# Altium schematic sheet 42. DISPLAY PORT.SchDoc: DISPLAY_PORT_INTERFACE
size 513 x 386 mm; Project: PROC154E2(001)_SK_AM69; Issue: 1.0; RevCode: E3; Page Create Date: March  8, 1995; Variant Name: Core Design; Schematic Page Number: 42; Page Number: 42; Page Size: C; Comment: MISTRAL_TITLEBLK_CSIZE_1; Page Count: 62; Schematic Page Count: 62; Name: PROC154E2 001 SK AM69; DsnPath: C:\Users\danie\Downloads\sprr466c\PROC154E3_RP\PROC154E3_SCH.DSN; SchematicName: SCHEMATIC1; PageName: 42. DISPLAY PORT; PageSize: C; TopSchematic: True
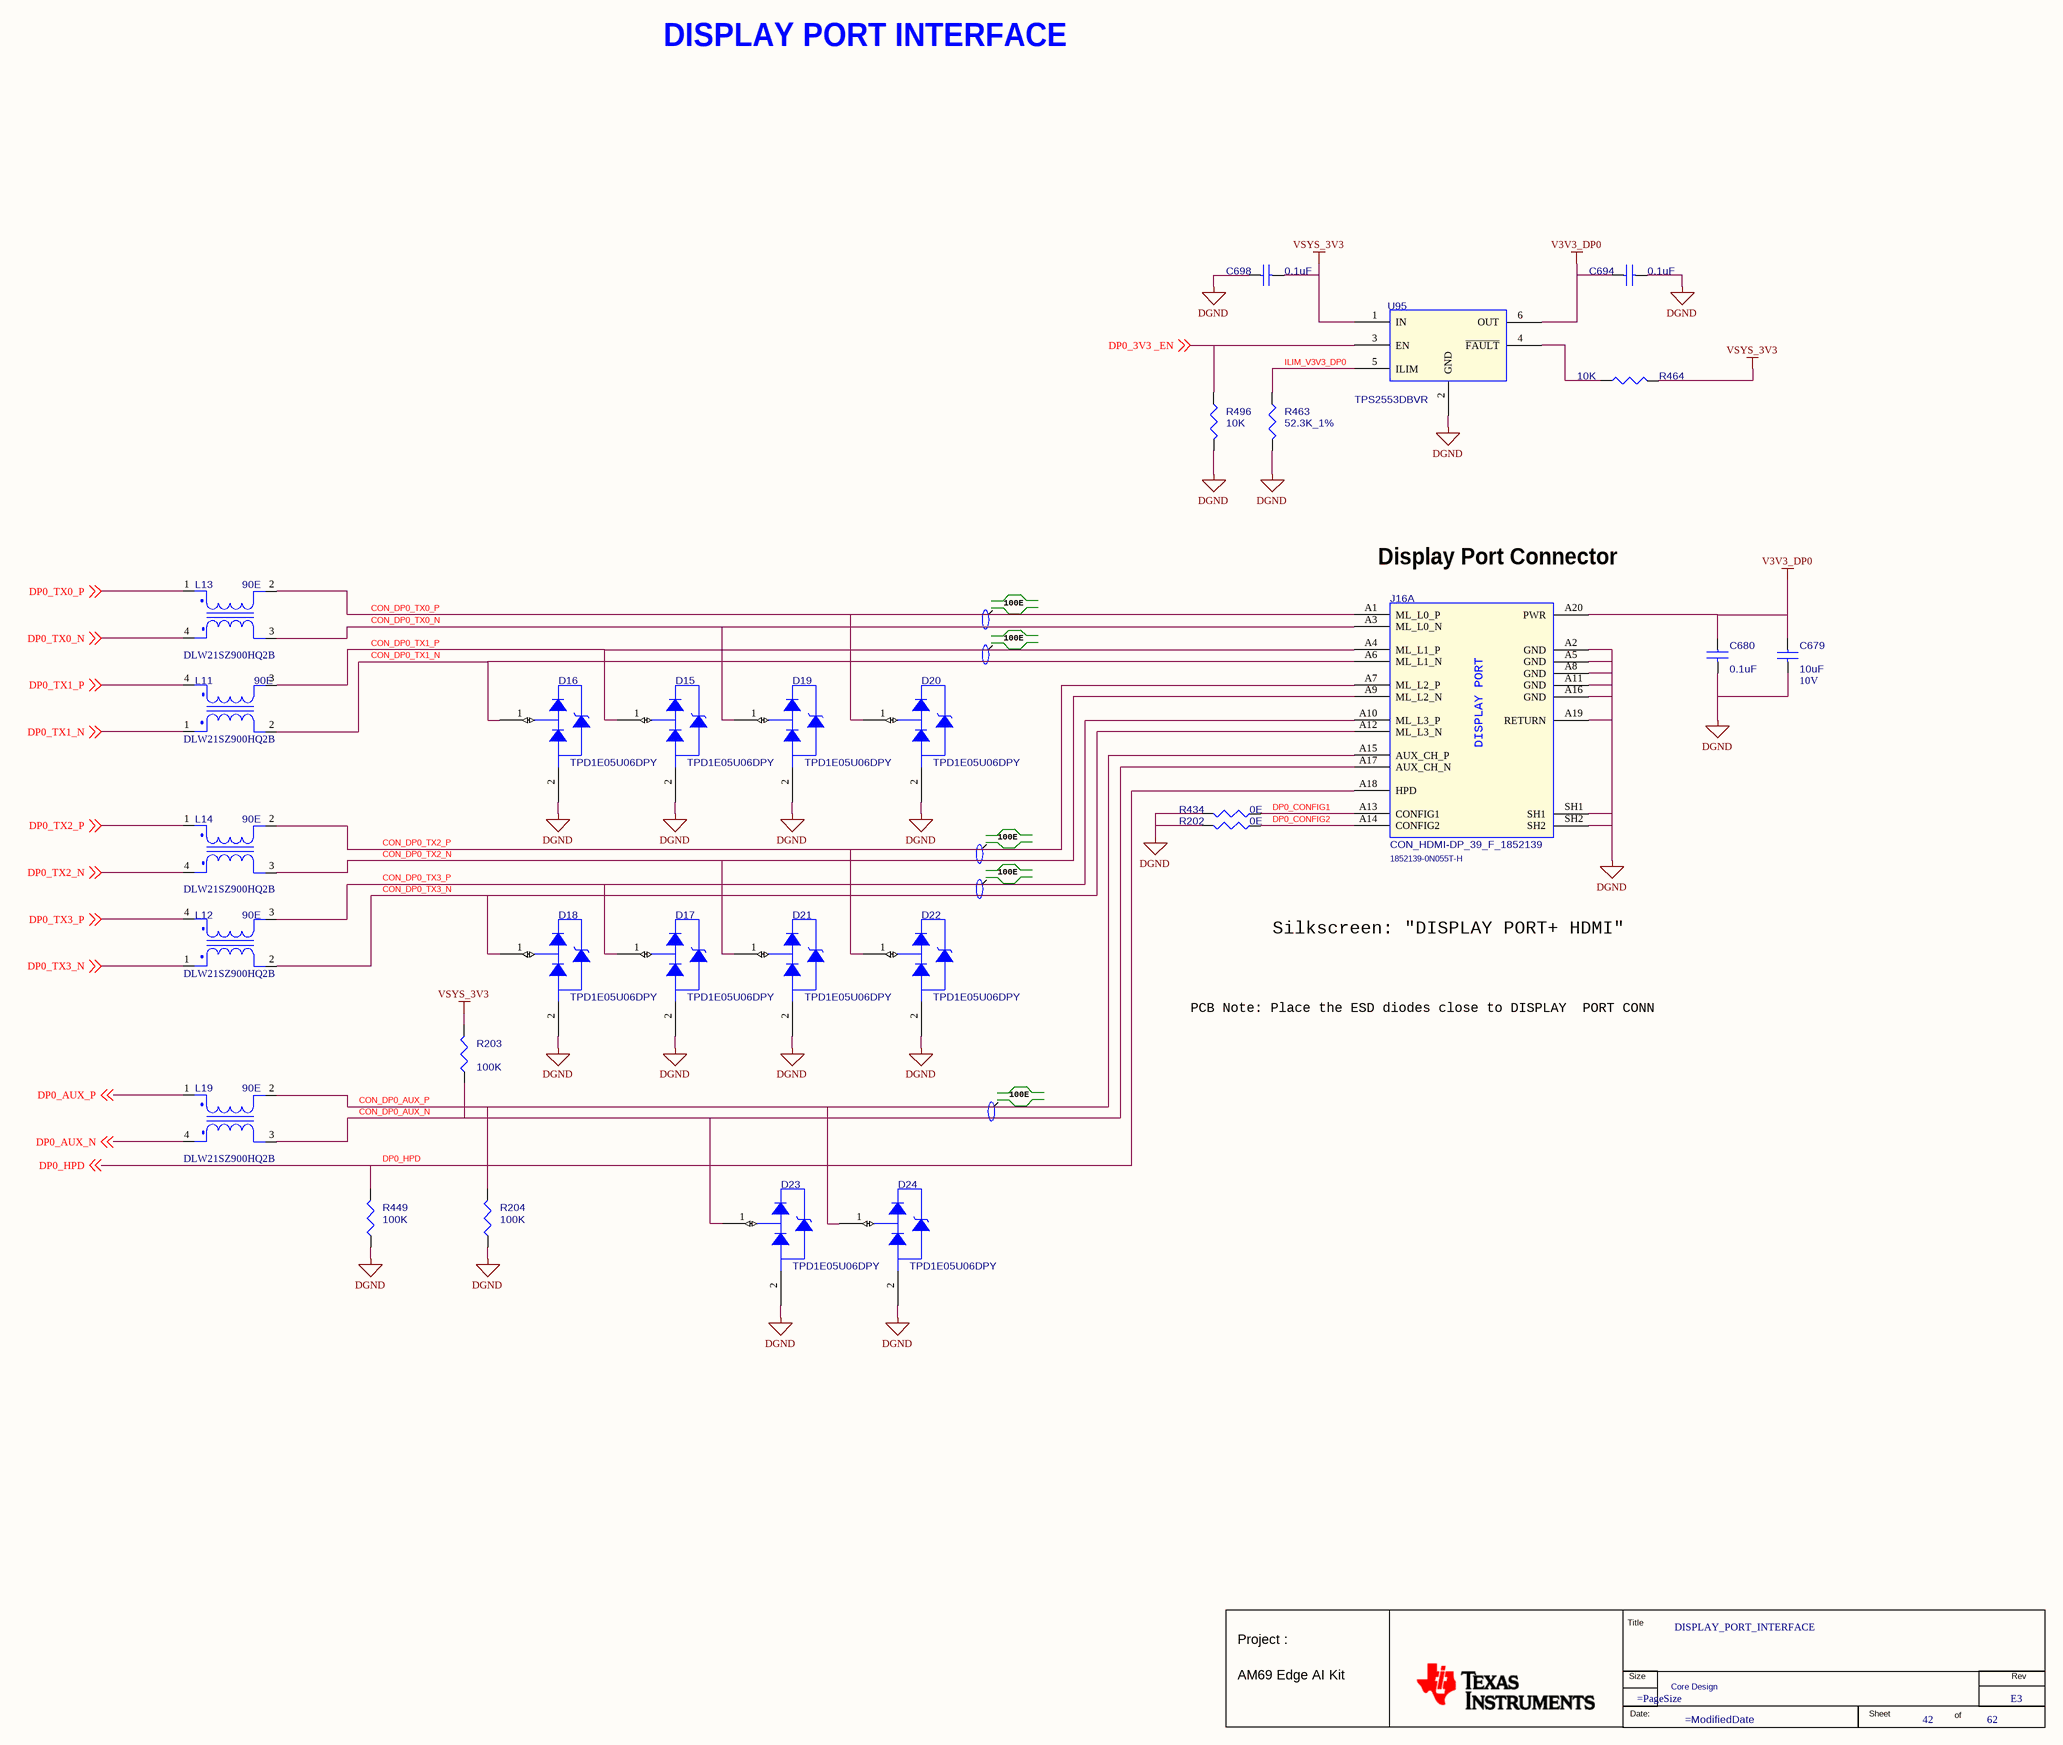
[diagram p0: 42. DISPLAY PORT.SchDoc]

## Parts
*  RevCode: E3  Title: DISPLAY_PORT_INTERFACE  Page Number: 42  Page Count: 62  Variant Name: Core Design  (hidden comment: MISTRAL_TITLEBLK_CSIZE_1)  (graphical)
C679  10uF  Voltage: 10V  [CAP0402_1]
C680  0.1uF  [CAP0201_0-5]
C694  0.1uF  [CAP0201_0-5]
C698  0.1uF  [CAP0201_0-5]
D15  TPD1E05U06DPY  [DIO_DFN0402_0-5]
D16  TPD1E05U06DPY  [DIO_DFN0402_0-5]
D17  TPD1E05U06DPY  [DIO_DFN0402_0-5]
D18  TPD1E05U06DPY  [DIO_DFN0402_0-5]
D19  TPD1E05U06DPY  [DIO_DFN0402_0-5]
D20  TPD1E05U06DPY  [DIO_DFN0402_0-5]
D21  TPD1E05U06DPY  [DIO_DFN0402_0-5]
D22  TPD1E05U06DPY  [DIO_DFN0402_0-5]
D23  TPD1E05U06DPY  [DIO_DFN0402_0-5]
D24  TPD1E05U06DPY  [DIO_DFN0402_0-5]
J16  CON_HDMI-DP_39_F_1852139  Mfr_part_number: 1852139-0N055T-H  [CON_HDMI-DP39_1852139-0N055_S_R_T_19-8]  (part A of 2)
L11  90E  Mfr_part_number: DLW21SZ900HQ2B  [IND4_DLW21H_90X60_SMD_1-4]
L12  90E  Mfr_part_number: DLW21SZ900HQ2B  [IND4_DLW21H_90X60_SMD_1-4]
L13  90E  Mfr_part_number: DLW21SZ900HQ2B  [IND4_DLW21H_90X60_SMD_1-4]
L14  90E  Mfr_part_number: DLW21SZ900HQ2B  [IND4_DLW21H_90X60_SMD_1-4]
L19  90E  Mfr_part_number: DLW21SZ900HQ2B  [IND4_DLW21H_90X60_SMD_1-4]
R202  0E  [RES0402_0-5]
R203  100K  [RES0402_0-5]
R204  100K  [RES0402_0-5]
R434  0E  [RES0402_0-5]
R449  100K  [RES0402_0-5]
R463  52.3K_1%  [RES0201_0-5]
R464  10K  [RES0201_0-5]
R496  10K  [RES0201_0-5]
U95  TPS2553DBVR  [SOT23-6_1-5]

## Nets
DGND: C679.2 C680.2 C694.2 C698.1 D15.2(GND) D16.2(GND) D17.2(GND) D18.2(GND) D19.2(GND) D20.2(GND) D21.2(GND) D22.2(GND) D23.2(GND) D24.2(GND) J16.A2(GND) J16.A5(GND) J16.A8(GND) J16.A11(GND) J16.A16(GND) J16.A19(RETURN) J16.SH1 J16.SH2 R202.2 R204.1 R434.2 R449.1 R463.2 R496.2 U95.2(GND)
V3V3_DP0: C679.1 C680.1 C694.1 J16.A20(PWR) U95.6(OUT)
VSYS_3V3: C698.2 R203.2 R464.1 U95.1(IN)
CON_DP0_AUX_N: D23.1(I/O) J16.A17(AUX_CH_N) L19.3(OUT1) R203.1
CON_DP0_AUX_P: D24.1(I/O) J16.A15(AUX_CH_P) L19.2(IN2) R204.2
CON_DP0_TX0_N: D19.1(I/O) J16.A3(ML_L0_N) L13.3(OUT1)
CON_DP0_TX0_P: D20.1(I/O) J16.A1(ML_L0_P) L13.2(IN2)
CON_DP0_TX1_N: D16.1(I/O) J16.A6(ML_L1_N) L11.2(IN2)
CON_DP0_TX1_P: D15.1(I/O) J16.A4(ML_L1_P) L11.3(OUT1)
CON_DP0_TX2_N: D21.1(I/O) J16.A9(ML_L2_N) L14.3(OUT1)
CON_DP0_TX2_P: D22.1(I/O) J16.A7(ML_L2_P) L14.2(IN2)
CON_DP0_TX3_N: D18.1(I/O) J16.A12(ML_L3_N) L12.2(IN2)
CON_DP0_TX3_P: D17.1(I/O) J16.A10(ML_L3_P) L12.3(OUT1)
DP0_3V3 _EN: R496.1 U95.3(EN) ; off-sheet DP0_3V3 _EN
DP0_AUX_N: L19.4(OUT2) ; off-sheet DP0_AUX_N
DP0_AUX_P: L19.1(IN1) ; off-sheet DP0_AUX_P
DP0_CONFIG1: J16.A13(CONFIG1) R434.1
DP0_CONFIG2: J16.A14(CONFIG2) R202.1
DP0_HPD: J16.A18(HPD) R449.2 ; off-sheet DP0_HPD
DP0_TX0_N: L13.4(OUT2) ; off-sheet DP0_TX0_N
DP0_TX0_P: L13.1(IN1) ; off-sheet DP0_TX0_P
DP0_TX1_N: L11.1(IN1) ; off-sheet DP0_TX1_N
DP0_TX1_P: L11.4(OUT2) ; off-sheet DP0_TX1_P
DP0_TX2_N: L14.4(OUT2) ; off-sheet DP0_TX2_N
DP0_TX2_P: L14.1(IN1) ; off-sheet DP0_TX2_P
DP0_TX3_N: L12.1(IN1) ; off-sheet DP0_TX3_N
DP0_TX3_P: L12.4(OUT2) ; off-sheet DP0_TX3_P
ILIM_V3V3_DP0: R463.1 U95.5(ILIM)
NetR464_2: R464.2 U95.4(~{FAULT})

## Notes on the sheet
- DISPLAY PORT INTERFACE
- (near J16) Display Port Connector
- 100E
- Silkscreen: "DISPLAY PORT+ HDMI"
- PCB Note: Place the ESD diodes close to DISPLAY  PORT CONN
- (in symbol CON_HDMI-DP_39_F_1852139, part A) DISPLAY PORT
- (in symbol MISTRAL_TITLEBLK_CSIZE_1) Title; Project :; Size; Rev; AM69 Edge AI Kit; Date:; Sheet; of

## Library data of the parts
* = MISTRAL_TITLEBLK_CSIZE_1: Issue: 1.0; Project: PROC154E2(001)_SK_AM69; Name: PROC154E2 001 SK AM69; Page Create Date: March  8, 1995; Page Size: =PageSize; Page Modify Date: =ModifiedDate; Schematic Page Count: 62; Schematic Page Number: 42
C679 = CAP_Dup1: CAP CERAMIC 10uF 10V 20% X5R 0402; Part Reference: C679; Part_type: CAPACITORS\CERAMIC; Mfr_part_number: CL05A106MP8NUB8; Mfr_name: SAMSUNG; Mistral Part No: 120019020008-R; Custom_Duty: 15%; Customs_HS_Code: 85322990; Project: TI_60GHz-AOP; Wattage: NA; Value: 10uF; PCB Footprint: CAP0402_1; Chkd/date: MANIRAJA/150219; Crtd /date: ALVY/150219; Datasheet: Y:\MIS_DATABASE\DATASHEETS\CAPACITORS\CL05A106MP8NUB8.PDF; Height: 0.90MM; Distributor_part_number: 1276-6830-1-ND; Distributor_name: DIGIKEY; Package: 0402; Tolerance: 20%; Library Ref: CAP; Footprint Ref: CAP0402_1; Weight: NA; Temperature: -55°C+85°C; MECHANICAL 3D STEP FILE: CAP0402_1; Library Path: Y:\MIS_DATABASE\Library\ALTIUM_TOOL\SCHEMATICS_PARTS\MS_DISCRETE_Library.schlib; Footprint Path: Y:\MIS_DATABASE\Library\ALTIUM_TOOL\PCB_FOOTPRINTS\Altium_Footprint_Lib.PcbLib
C680 = CAP_Dup1: CAP CERAMIC 0.1uF 16V 10% X7S AUTO 0201; Part Reference: C680; Mistral Part No: 120021030007-R; Mfr_name: MURATA; Mfr_part_number: GRT033C71C104KE01D; Part_type: CAPACITORS\CERAMIC; Project: J7ES_SK_BRD; Wattage: NA; Customs_HS_Code: 85322990; Custom_Duty: 15%; Value: 0.1uF; PCB Footprint: CAP0201_0-5; Tolerance: 10%; Voltage: 16V; Package: 0201; Distributor_name: DIGIKEY; Distributor_part_number: 490-GRT033C71C104KE01DTR-ND; Height: 0.33MM; Weight: 330mg; Temperature: -55°C+125°C; Datasheet: Y:\MIS_DATABASE\DATASHEETS\CAPACITORS\GRT033C71C104KE01.PDF; Crtd /date: ALVY/110321; Chkd/date: MANIRAJA/110321; MECHANICAL 3D STEP FILE: CAP0201_0-5
C694 = CAP_Dup1: CAP CERAMIC 0.1uF 16V 10% X7S AUTO 0201; Part Reference: C694; Part_type: CAPACITORS\CERAMIC; Mfr_part_number: GRT033C71C104KE01D; Mfr_name: MURATA; Mistral Part No: 120021030007-R; Custom_Duty: 15%; Customs_HS_Code: 85322990; Wattage: NA; Project: J7ES_SK_BRD; Value: 0.1uF; PCB Footprint: CAP0201_0-5; MECHANICAL 3D STEP FILE: CAP0201_0-5; Chkd/date: MANIRAJA/110321; Crtd /date: ALVY/110321; Datasheet: Y:\MIS_DATABASE\DATASHEETS\CAPACITORS\GRT033C71C104KE01.PDF; Temperature: -55°C+125°C; Weight: 330mg; Height: 0.33MM; Distributor_part_number: 490-GRT033C71C104KE01DTR-ND; Distributor_name: DIGIKEY; Package: 0201; Voltage: 16V; Tolerance: 10%
C698 = CAP_Dup1: CAP CERAMIC 0.1uF 16V 10% X7S AUTO 0201; Part Reference: C698; Mistral Part No: 120021030007-R; Mfr_name: MURATA; Mfr_part_number: GRT033C71C104KE01D; Part_type: CAPACITORS\CERAMIC; Project: J7ES_SK_BRD; Wattage: NA; Customs_HS_Code: 85322990; Custom_Duty: 15%; Value: 0.1uF; PCB Footprint: CAP0201_0-5; Tolerance: 10%; Voltage: 16V; Package: 0201; Distributor_name: DIGIKEY; Distributor_part_number: 490-GRT033C71C104KE01DTR-ND; Height: 0.33MM; Weight: 330mg; Temperature: -55°C+125°C; Datasheet: Y:\MIS_DATABASE\DATASHEETS\CAPACITORS\GRT033C71C104KE01.PDF; Crtd /date: ALVY/110321; Chkd/date: MANIRAJA/110321; MECHANICAL 3D STEP FILE: CAP0201_0-5
D15 = DIODE_TPD1E05U06: DIODE 1CH ESD PROTECTION FOR INTERFACE X1SON2; Part Reference: D15; Mistral Part No: 130018060037-R; Mfr_name: TEXAS INSTRUMENTS; Mfr_part_number: TPD1E05U06DPYT; Part_type: DIODE\TVS; Project: GOLDEN-I LITE; Tolerance: NA; Customs_HS_Code: 85412900; Custom_Duty: 15%; Value: TPD1E05U06DPY; PCB Footprint: DIO_DFN0402_0-5; Footprint Ref: DIO_DFN0402_0-5; Voltage: NA; Wattage: NA; Package: X1SON2; Distributor_name: DIGIKEY; Distributor_part_number: 296-39342-1-ND; Library Ref: DIODE_TPD1E05U06; Height: 0.45MM; Weight: 1mg; Temperature: -40°C+125°C; Datasheet: Y:\MIS_DATABASE\DATASHEETS\DISCRETES\DIODES\TPDXE05U06.PDF; Crtd /date: MANIRAJA/290618; Chkd/date: MANIRAJA/290618; MECHANICAL 3D STEP FILE: DIO_DFN0402_0-5; Library Path: Y:\MIS_DATABASE\Library\ALTIUM_TOOL\SCHEMATICS_PARTS\MS_DISCRETE_Library.schlib; Footprint Path: Y:\MIS_DATABASE\Library\ALTIUM_TOOL\PCB_FOOTPRINTS\Altium_Footprint_Lib.PcbLib
D16 = DIODE_TPD1E05U06: DIODE 1CH ESD PROTECTION FOR INTERFACE X1SON2; Part Reference: D16; Mistral Part No: 130018060037-R; Mfr_name: TEXAS INSTRUMENTS; Mfr_part_number: TPD1E05U06DPYT; Part_type: DIODE\TVS; Project: GOLDEN-I LITE; Tolerance: NA; Customs_HS_Code: 85412900; Custom_Duty: 15%; Value: TPD1E05U06DPY; PCB Footprint: DIO_DFN0402_0-5; Footprint Ref: DIO_DFN0402_0-5; Voltage: NA; Wattage: NA; Package: X1SON2; Distributor_name: DIGIKEY; Distributor_part_number: 296-39342-1-ND; Library Ref: DIODE_TPD1E05U06; Height: 0.45MM; Weight: 1mg; Temperature: -40°C+125°C; Datasheet: Y:\MIS_DATABASE\DATASHEETS\DISCRETES\DIODES\TPDXE05U06.PDF; Crtd /date: MANIRAJA/290618; Chkd/date: MANIRAJA/290618; MECHANICAL 3D STEP FILE: DIO_DFN0402_0-5; Library Path: Y:\MIS_DATABASE\Library\ALTIUM_TOOL\SCHEMATICS_PARTS\MS_DISCRETE_Library.schlib; Footprint Path: Y:\MIS_DATABASE\Library\ALTIUM_TOOL\PCB_FOOTPRINTS\Altium_Footprint_Lib.PcbLib
D17 = DIODE_TPD1E05U06: DIODE 1CH ESD PROTECTION FOR INTERFACE X1SON2; Part Reference: D17; Mistral Part No: 130018060037-R; Mfr_name: TEXAS INSTRUMENTS; Mfr_part_number: TPD1E05U06DPYT; Part_type: DIODE\TVS; Project: GOLDEN-I LITE; Tolerance: NA; Customs_HS_Code: 85412900; Custom_Duty: 15%; Value: TPD1E05U06DPY; PCB Footprint: DIO_DFN0402_0-5; Footprint Ref: DIO_DFN0402_0-5; Voltage: NA; Wattage: NA; Package: X1SON2; Distributor_name: DIGIKEY; Distributor_part_number: 296-39342-1-ND; Library Ref: DIODE_TPD1E05U06; Height: 0.45MM; Weight: 1mg; Temperature: -40°C+125°C; Datasheet: Y:\MIS_DATABASE\DATASHEETS\DISCRETES\DIODES\TPDXE05U06.PDF; Crtd /date: MANIRAJA/290618; Chkd/date: MANIRAJA/290618; MECHANICAL 3D STEP FILE: DIO_DFN0402_0-5; Library Path: Y:\MIS_DATABASE\Library\ALTIUM_TOOL\SCHEMATICS_PARTS\MS_DISCRETE_Library.schlib; Footprint Path: Y:\MIS_DATABASE\Library\ALTIUM_TOOL\PCB_FOOTPRINTS\Altium_Footprint_Lib.PcbLib
D18 = DIODE_TPD1E05U06: DIODE 1CH ESD PROTECTION FOR INTERFACE X1SON2; Part Reference: D18; Mistral Part No: 130018060037-R; Mfr_name: TEXAS INSTRUMENTS; Mfr_part_number: TPD1E05U06DPYT; Part_type: DIODE\TVS; Project: GOLDEN-I LITE; Tolerance: NA; Customs_HS_Code: 85412900; Custom_Duty: 15%; Value: TPD1E05U06DPY; PCB Footprint: DIO_DFN0402_0-5; Footprint Ref: DIO_DFN0402_0-5; Voltage: NA; Wattage: NA; Package: X1SON2; Distributor_name: DIGIKEY; Distributor_part_number: 296-39342-1-ND; Library Ref: DIODE_TPD1E05U06; Height: 0.45MM; Weight: 1mg; Temperature: -40°C+125°C; Datasheet: Y:\MIS_DATABASE\DATASHEETS\DISCRETES\DIODES\TPDXE05U06.PDF; Crtd /date: MANIRAJA/290618; Chkd/date: MANIRAJA/290618; MECHANICAL 3D STEP FILE: DIO_DFN0402_0-5; Library Path: Y:\MIS_DATABASE\Library\ALTIUM_TOOL\SCHEMATICS_PARTS\MS_DISCRETE_Library.schlib; Footprint Path: Y:\MIS_DATABASE\Library\ALTIUM_TOOL\PCB_FOOTPRINTS\Altium_Footprint_Lib.PcbLib
D19 = DIODE_TPD1E05U06: DIODE 1CH ESD PROTECTION FOR INTERFACE X1SON2; Part Reference: D19; Mistral Part No: 130018060037-R; Mfr_name: TEXAS INSTRUMENTS; Mfr_part_number: TPD1E05U06DPYT; Part_type: DIODE\TVS; Project: GOLDEN-I LITE; Tolerance: NA; Customs_HS_Code: 85412900; Custom_Duty: 15%; Value: TPD1E05U06DPY; PCB Footprint: DIO_DFN0402_0-5; Footprint Ref: DIO_DFN0402_0-5; Voltage: NA; Wattage: NA; Package: X1SON2; Distributor_name: DIGIKEY; Distributor_part_number: 296-39342-1-ND; Library Ref: DIODE_TPD1E05U06; Height: 0.45MM; Weight: 1mg; Temperature: -40°C+125°C; Datasheet: Y:\MIS_DATABASE\DATASHEETS\DISCRETES\DIODES\TPDXE05U06.PDF; Crtd /date: MANIRAJA/290618; Chkd/date: MANIRAJA/290618; MECHANICAL 3D STEP FILE: DIO_DFN0402_0-5; Library Path: Y:\MIS_DATABASE\Library\ALTIUM_TOOL\SCHEMATICS_PARTS\MS_DISCRETE_Library.schlib; Footprint Path: Y:\MIS_DATABASE\Library\ALTIUM_TOOL\PCB_FOOTPRINTS\Altium_Footprint_Lib.PcbLib
D20 = DIODE_TPD1E05U06: DIODE 1CH ESD PROTECTION FOR INTERFACE X1SON2; Part Reference: D20; Part_type: DIODE\TVS; Mfr_part_number: TPD1E05U06DPYT; Mfr_name: TEXAS INSTRUMENTS; Mistral Part No: 130018060037-R; Custom_Duty: 15%; Customs_HS_Code: 85412900; Wattage: NA; Project: GOLDEN-I LITE; Value: TPD1E05U06DPY; PCB Footprint: DIO_DFN0402_0-5; Footprint Path: Y:\MIS_DATABASE\Library\ALTIUM_TOOL\PCB_FOOTPRINTS\Altium_Footprint_Lib.PcbLib; Library Path: Y:\MIS_DATABASE\Library\ALTIUM_TOOL\SCHEMATICS_PARTS\MS_DISCRETE_Library.schlib; MECHANICAL 3D STEP FILE: DIO_DFN0402_0-5; Chkd/date: MANIRAJA/290618; Crtd /date: MANIRAJA/290618; Datasheet: Y:\MIS_DATABASE\DATASHEETS\DISCRETES\DIODES\TPDXE05U06.PDF; Temperature: -40°C+125°C; Weight: 1mg; Height: 0.45MM; Library Ref: DIODE_TPD1E05U06; Distributor_part_number: 296-39342-1-ND; Distributor_name: DIGIKEY; Package: X1SON2; Voltage: NA; Tolerance: NA; Footprint Ref: DIO_DFN0402_0-5
D21 = DIODE_TPD1E05U06: DIODE 1CH ESD PROTECTION FOR INTERFACE X1SON2; Part Reference: D21; Mistral Part No: 130018060037-R; Mfr_name: TEXAS INSTRUMENTS; Mfr_part_number: TPD1E05U06DPYT; Part_type: DIODE\TVS; Project: GOLDEN-I LITE; Tolerance: NA; Customs_HS_Code: 85412900; Custom_Duty: 15%; Value: TPD1E05U06DPY; PCB Footprint: DIO_DFN0402_0-5; Footprint Ref: DIO_DFN0402_0-5; Voltage: NA; Wattage: NA; Package: X1SON2; Distributor_name: DIGIKEY; Distributor_part_number: 296-39342-1-ND; Library Ref: DIODE_TPD1E05U06; Height: 0.45MM; Weight: 1mg; Temperature: -40°C+125°C; Datasheet: Y:\MIS_DATABASE\DATASHEETS\DISCRETES\DIODES\TPDXE05U06.PDF; Crtd /date: MANIRAJA/290618; Chkd/date: MANIRAJA/290618; MECHANICAL 3D STEP FILE: DIO_DFN0402_0-5; Library Path: Y:\MIS_DATABASE\Library\ALTIUM_TOOL\SCHEMATICS_PARTS\MS_DISCRETE_Library.schlib; Footprint Path: Y:\MIS_DATABASE\Library\ALTIUM_TOOL\PCB_FOOTPRINTS\Altium_Footprint_Lib.PcbLib
D22 = DIODE_TPD1E05U06: DIODE 1CH ESD PROTECTION FOR INTERFACE X1SON2; Part Reference: D22; Part_type: DIODE\TVS; Mfr_part_number: TPD1E05U06DPYT; Mfr_name: TEXAS INSTRUMENTS; Mistral Part No: 130018060037-R; Custom_Duty: 15%; Customs_HS_Code: 85412900; Wattage: NA; Project: GOLDEN-I LITE; Value: TPD1E05U06DPY; PCB Footprint: DIO_DFN0402_0-5; Footprint Path: Y:\MIS_DATABASE\Library\ALTIUM_TOOL\PCB_FOOTPRINTS\Altium_Footprint_Lib.PcbLib; Library Path: Y:\MIS_DATABASE\Library\ALTIUM_TOOL\SCHEMATICS_PARTS\MS_DISCRETE_Library.schlib; MECHANICAL 3D STEP FILE: DIO_DFN0402_0-5; Chkd/date: MANIRAJA/290618; Crtd /date: MANIRAJA/290618; Datasheet: Y:\MIS_DATABASE\DATASHEETS\DISCRETES\DIODES\TPDXE05U06.PDF; Temperature: -40°C+125°C; Weight: 1mg; Height: 0.45MM; Library Ref: DIODE_TPD1E05U06; Distributor_part_number: 296-39342-1-ND; Distributor_name: DIGIKEY; Package: X1SON2; Voltage: NA; Tolerance: NA; Footprint Ref: DIO_DFN0402_0-5
D23 = DIODE_TPD1E05U06: DIODE 1CH ESD PROTECTION FOR INTERFACE X1SON2; Part Reference: D23; Part_type: DIODE\TVS; Mfr_part_number: TPD1E05U06DPYT; Mfr_name: TEXAS INSTRUMENTS; Mistral Part No: 130018060037-R; Custom_Duty: 15%; Customs_HS_Code: 85412900; Wattage: NA; Project: GOLDEN-I LITE; Value: TPD1E05U06DPY; PCB Footprint: DIO_DFN0402_0-5; Footprint Path: Y:\MIS_DATABASE\Library\ALTIUM_TOOL\PCB_FOOTPRINTS\Altium_Footprint_Lib.PcbLib; Library Path: Y:\MIS_DATABASE\Library\ALTIUM_TOOL\SCHEMATICS_PARTS\MS_DISCRETE_Library.schlib; MECHANICAL 3D STEP FILE: DIO_DFN0402_0-5; Chkd/date: MANIRAJA/290618; Crtd /date: MANIRAJA/290618; Datasheet: Y:\MIS_DATABASE\DATASHEETS\DISCRETES\DIODES\TPDXE05U06.PDF; Temperature: -40°C+125°C; Weight: 1mg; Height: 0.45MM; Library Ref: DIODE_TPD1E05U06; Distributor_part_number: 296-39342-1-ND; Distributor_name: DIGIKEY; Package: X1SON2; Voltage: NA; Tolerance: NA; Footprint Ref: DIO_DFN0402_0-5
D24 = DIODE_TPD1E05U06: DIODE 1CH ESD PROTECTION FOR INTERFACE X1SON2; Part Reference: D24; Part_type: DIODE\TVS; Mfr_part_number: TPD1E05U06DPYT; Mfr_name: TEXAS INSTRUMENTS; Mistral Part No: 130018060037-R; Custom_Duty: 15%; Customs_HS_Code: 85412900; Wattage: NA; Project: GOLDEN-I LITE; Value: TPD1E05U06DPY; PCB Footprint: DIO_DFN0402_0-5; Footprint Path: Y:\MIS_DATABASE\Library\ALTIUM_TOOL\PCB_FOOTPRINTS\Altium_Footprint_Lib.PcbLib; Library Path: Y:\MIS_DATABASE\Library\ALTIUM_TOOL\SCHEMATICS_PARTS\MS_DISCRETE_Library.schlib; MECHANICAL 3D STEP FILE: DIO_DFN0402_0-5; Chkd/date: MANIRAJA/290618; Crtd /date: MANIRAJA/290618; Datasheet: Y:\MIS_DATABASE\DATASHEETS\DISCRETES\DIODES\TPDXE05U06.PDF; Temperature: -40°C+125°C; Weight: 1mg; Height: 0.45MM; Library Ref: DIODE_TPD1E05U06; Distributor_part_number: 296-39342-1-ND; Distributor_name: DIGIKEY; Package: X1SON2; Voltage: NA; Tolerance: NA; Footprint Ref: DIO_DFN0402_0-5
J16 = CON_HDMI-DP_39_F_1852139: CON HDMI AND DISPLAY PORT STACKED 39POS FEMALE RT TH; Part Reference: J16; Mistral Part No: 150021020056; Mfr_name: ASTRON; Part_type: CONNECTOR\JACK; Project: J7ES_SK_BRD; Tolerance: NA; Customs_HS_Code: 85369090; Custom_Duty: 24%; Value: CON_HDMI-DP_39_F_1852139; PCB Footprint: CON_HDMI-DP39_1852139-0N055_S_R_T_19-8; Footprint Ref: CON_HDMI-DP39_1852139-0N055_S_R_T_19-8; Voltage: NA; Wattage: NA; Package: THRU-HOLE; Distributor_name: NA; Distributor_part_number: NA; Library Ref: CON_HDMI-DP_39_F_1852139; Height: 19.80MM; Weight: NA; Temperature: -25°C+85°C; Datasheet: Y:\MIS_DATABASE\DATASHEETS\CONNECTORS\1852139-0N055T-H.PDF; Crtd /date: ALVY/180221; Chkd/date: MANIRAJA/190221; RoHS: NA; MECHANICAL 3D STEP FILE: CON_HDMI-DP39_1852139-0N055_S_R_T_19-8; Library Path: Y:\MIS_DATABASE\Library\ALTIUM_TOOL\SCHEMATICS_PARTS\MS_CONNECTOR_Library.schlib; Footprint Path: Y:\MIS_DATABASE\Library\ALTIUM_TOOL\PCB_FOOTPRINTS\Altium_Footprint_Lib.PcbLib
L11 = INDUCTOR_DLW31S: IND COMMON MODE CHOKE 90E 280mA SMD; Part Reference: L11; Mfr_name: MURATA; Mistral Part No: 130019060035-R; Custom_Duty: 24%; Customs_HS_Code: 85437099; Wattage: NA; Project: TI_J7ES_CP; SIGNAL_MODEL: INDUCTOR_DLW31S_IND4_DLW21H_90X_90E; Value: 90E; PCB Footprint: IND4_DLW21H_90X60_SMD_1-4; Footprint Path: Y:\MIS_DATABASE\Library\ALTIUM_TOOL\PCB_FOOTPRINTS\Altium_Footprint_Lib.PcbLib; Library Path: Y:\MIS_DATABASE\Library\ALTIUM_TOOL\SCHEMATICS_PARTS\MS_DISCRETE_Library.schlib; MECHANICAL 3D STEP FILE: IND4_DLW21H_90X60_SMD_1-4; Chkd/date: MANIRAJA/270619; Crtd /date: MANIRAJA/270619; Datasheet: Y:\MIS_DATABASE\DATASHEETS\DISCRETES\INDUCTORS\DLW21SZ900HQ2B.PDF; Temperature: -40°C+105°C; Weight: 11mg; Height: 1.40MM; Library Ref: INDUCTOR_DLW31S; Distributor_part_number: NA; Distributor_name: NA; Package: SMD; Voltage: NA; Tolerance: NA; Part_type: INDUCTOR; Footprint Ref: IND4_DLW21H_90X60_SMD_1-4
L12 = INDUCTOR_DLW31S: IND COMMON MODE CHOKE 90E 280mA SMD; Part Reference: L12; Mfr_name: MURATA; Mistral Part No: 130019060035-R; Custom_Duty: 24%; Customs_HS_Code: 85437099; Wattage: NA; Project: TI_J7ES_CP; SIGNAL_MODEL: INDUCTOR_DLW31S_IND4_DLW21H_90X_90E; Value: 90E; PCB Footprint: IND4_DLW21H_90X60_SMD_1-4; Footprint Path: Y:\MIS_DATABASE\Library\ALTIUM_TOOL\PCB_FOOTPRINTS\Altium_Footprint_Lib.PcbLib; Library Path: Y:\MIS_DATABASE\Library\ALTIUM_TOOL\SCHEMATICS_PARTS\MS_DISCRETE_Library.schlib; MECHANICAL 3D STEP FILE: IND4_DLW21H_90X60_SMD_1-4; Chkd/date: MANIRAJA/270619; Crtd /date: MANIRAJA/270619; Datasheet: Y:\MIS_DATABASE\DATASHEETS\DISCRETES\INDUCTORS\DLW21SZ900HQ2B.PDF; Temperature: -40°C+105°C; Weight: 11mg; Height: 1.40MM; Library Ref: INDUCTOR_DLW31S; Distributor_part_number: NA; Distributor_name: NA; Package: SMD; Voltage: NA; Tolerance: NA; Part_type: INDUCTOR; Footprint Ref: IND4_DLW21H_90X60_SMD_1-4
L13 = INDUCTOR_DLW31S: IND COMMON MODE CHOKE 90E 280mA SMD; Part Reference: L13; Mistral Part No: 130019060035-R; Mfr_name: MURATA; Project: TI_J7ES_CP; Tolerance: NA; Customs_HS_Code: 85437099; Custom_Duty: 24%; SIGNAL_MODEL: INDUCTOR_DLW31S_IND4_DLW21H_90X_90E; Value: 90E; PCB Footprint: IND4_DLW21H_90X60_SMD_1-4; Footprint Ref: IND4_DLW21H_90X60_SMD_1-4; Part_type: INDUCTOR; Voltage: NA; Wattage: NA; Package: SMD; Distributor_name: NA; Distributor_part_number: NA; Library Ref: INDUCTOR_DLW31S; Height: 1.40MM; Weight: 11mg; Temperature: -40°C+105°C; Datasheet: Y:\MIS_DATABASE\DATASHEETS\DISCRETES\INDUCTORS\DLW21SZ900HQ2B.PDF; Crtd /date: MANIRAJA/270619; Chkd/date: MANIRAJA/270619; MECHANICAL 3D STEP FILE: IND4_DLW21H_90X60_SMD_1-4; Library Path: Y:\MIS_DATABASE\Library\ALTIUM_TOOL\SCHEMATICS_PARTS\MS_DISCRETE_Library.schlib; Footprint Path: Y:\MIS_DATABASE\Library\ALTIUM_TOOL\PCB_FOOTPRINTS\Altium_Footprint_Lib.PcbLib
L14 = INDUCTOR_DLW31S: IND COMMON MODE CHOKE 90E 280mA SMD; Part Reference: L14; Mistral Part No: 130019060035-R; Mfr_name: MURATA; Project: TI_J7ES_CP; Tolerance: NA; Customs_HS_Code: 85437099; Custom_Duty: 24%; SIGNAL_MODEL: INDUCTOR_DLW31S_IND4_DLW21H_90X_90E; Value: 90E; PCB Footprint: IND4_DLW21H_90X60_SMD_1-4; Footprint Ref: IND4_DLW21H_90X60_SMD_1-4; Part_type: INDUCTOR; Voltage: NA; Wattage: NA; Package: SMD; Distributor_name: NA; Distributor_part_number: NA; Library Ref: INDUCTOR_DLW31S; Height: 1.40MM; Weight: 11mg; Temperature: -40°C+105°C; Datasheet: Y:\MIS_DATABASE\DATASHEETS\DISCRETES\INDUCTORS\DLW21SZ900HQ2B.PDF; Crtd /date: MANIRAJA/270619; Chkd/date: MANIRAJA/270619; MECHANICAL 3D STEP FILE: IND4_DLW21H_90X60_SMD_1-4; Library Path: Y:\MIS_DATABASE\Library\ALTIUM_TOOL\SCHEMATICS_PARTS\MS_DISCRETE_Library.schlib; Footprint Path: Y:\MIS_DATABASE\Library\ALTIUM_TOOL\PCB_FOOTPRINTS\Altium_Footprint_Lib.PcbLib
L19 = INDUCTOR_DLW31S: IND COMMON MODE CHOKE 90E 280mA SMD; Part Reference: L19; Mfr_name: MURATA; Mistral Part No: 130019060035-R; Custom_Duty: 24%; Customs_HS_Code: 85437099; Wattage: NA; Project: TI_J7ES_CP; SIGNAL_MODEL: INDUCTOR_DLW31S_IND4_DLW21H_90X_90E; Value: 90E; PCB Footprint: IND4_DLW21H_90X60_SMD_1-4; Footprint Path: Y:\MIS_DATABASE\Library\ALTIUM_TOOL\PCB_FOOTPRINTS\Altium_Footprint_Lib.PcbLib; Library Path: Y:\MIS_DATABASE\Library\ALTIUM_TOOL\SCHEMATICS_PARTS\MS_DISCRETE_Library.schlib; MECHANICAL 3D STEP FILE: IND4_DLW21H_90X60_SMD_1-4; Chkd/date: MANIRAJA/270619; Crtd /date: MANIRAJA/270619; Datasheet: Y:\MIS_DATABASE\DATASHEETS\DISCRETES\INDUCTORS\DLW21SZ900HQ2B.PDF; Temperature: -40°C+105°C; Weight: 11mg; Height: 1.40MM; Library Ref: INDUCTOR_DLW31S; Distributor_part_number: NA; Distributor_name: NA; Package: SMD; Voltage: NA; Tolerance: NA; Part_type: INDUCTOR; Footprint Ref: IND4_DLW21H_90X60_SMD_1-4
R202 = RESISTOR_Dup2: RES 0E 1/10W JUMPER 0402; Part Reference: R202; Part_type: RESISTORS\FIXED; Mfr_part_number: ERJ-2GE0R00X; Mfr_name: PANASONIC-ECG; Mistral Part No: 110018030052-R; Custom_Duty: 15%; Customs_HS_Code: 85332119; Voltage: NA; Project: AEGIS POM; Value: 0E; PCB Footprint: RES0402_0-5; Footprint Path: Y:\MIS_DATABASE\Library\ALTIUM_TOOL\PCB_FOOTPRINTS\Altium_Footprint_Lib.PcbLib; Library Path: Y:\MIS_DATABASE\Library\ALTIUM_TOOL\SCHEMATICS_PARTS\MS_DISCRETE_Library.schlib; Footprint Ref: RES0402_0-5; Library Ref: RESISTOR; Chkd/date: VASANTHA/061216; Crtd /date: NAVEED/201014; Datasheet: Y:\MIS_DATABASE\DATASHEETS\RESISTORS\PAN-ERJSER_NOV17.PDF; Temperature: -55°C+155°C; Weight: 0.8mg; Height: 0.40MM; Distributor_part_number: P0.0JCT-ND; Distributor_name: DIGIKEY; Package: 0402; Wattage: 1/10W; Tolerance: NA; MECHANICAL 3D STEP FILE: RES0402_0-5
R203 = RESISTOR_Dup2: RES 100K 1/10W 5% 0402; Part Reference: R203; Mistral Part No: 110009030177-R; Mfr_name: PANASONIC-ECG; Mfr_part_number: ERJ-2GEJ104X; Part_type: RESISTORS\FIXED; Project: RED EYE; Voltage: NA; Customs_HS_Code: 85332119; Custom_Duty: 15%; Value: 100K; PCB Footprint: RES0402_0-5; Tolerance: 5%; Wattage: 1/10W; Package: 0402; Distributor_name: DIGIKEY; Distributor_part_number: P100KJCT-ND; Height: 0.40MM; Weight: 0.8mg; Temperature: -55°C+155°C; Datasheet: Y:\MIS_DATABASE\DATASHEETS\RESISTORS\PAN-ERJSER_NOV17.PDF; Crtd /date: GEETHA/190406; Chkd/date: VASANTHA/291216; Library Ref: RESISTOR; Footprint Ref: RES0402_0-5; MECHANICAL 3D STEP FILE: RES0402_0-5; Library Path: Y:\MIS_DATABASE\Library\ALTIUM_TOOL\SCHEMATICS_PARTS\MS_DISCRETE_Library.schlib; Footprint Path: Y:\MIS_DATABASE\Library\ALTIUM_TOOL\PCB_FOOTPRINTS\Altium_Footprint_Lib.PcbLib
R204 = RESISTOR_Dup2: RES 100K 1/10W 5% 0402; Part Reference: R204; Part_type: RESISTORS\FIXED; Mfr_part_number: ERJ-2GEJ104X; Mfr_name: PANASONIC-ECG; Mistral Part No: 110009030177-R; Custom_Duty: 15%; Customs_HS_Code: 85332119; Voltage: NA; Project: RED EYE; Value: 100K; PCB Footprint: RES0402_0-5; Footprint Path: Y:\MIS_DATABASE\Library\ALTIUM_TOOL\PCB_FOOTPRINTS\Altium_Footprint_Lib.PcbLib; Library Path: Y:\MIS_DATABASE\Library\ALTIUM_TOOL\SCHEMATICS_PARTS\MS_DISCRETE_Library.schlib; MECHANICAL 3D STEP FILE: RES0402_0-5; Footprint Ref: RES0402_0-5; Library Ref: RESISTOR; Chkd/date: VASANTHA/291216; Crtd /date: GEETHA/190406; Datasheet: Y:\MIS_DATABASE\DATASHEETS\RESISTORS\PAN-ERJSER_NOV17.PDF; Temperature: -55°C+155°C; Weight: 0.8mg; Height: 0.40MM; Distributor_part_number: P100KJCT-ND; Distributor_name: DIGIKEY; Package: 0402; Wattage: 1/10W; Tolerance: 5%
R434 = RESISTOR_Dup2: RES 0E 1/10W JUMPER 0402; Part Reference: R434; Mistral Part No: 110018030052-R; Mfr_name: PANASONIC-ECG; Mfr_part_number: ERJ-2GE0R00X; Part_type: RESISTORS\FIXED; Project: AEGIS POM; Tolerance: NA; Customs_HS_Code: 85332119; Custom_Duty: 15%; Value: 0E; PCB Footprint: RES0402_0-5; MECHANICAL 3D STEP FILE: RES0402_0-5; Voltage: NA; Wattage: 1/10W; Package: 0402; Distributor_name: DIGIKEY; Distributor_part_number: P0.0JCT-ND; Height: 0.40MM; Weight: 0.8mg; Temperature: -55°C+155°C; Datasheet: Y:\MIS_DATABASE\DATASHEETS\RESISTORS\PAN-ERJSER_NOV17.PDF; Crtd /date: NAVEED/201014; Chkd/date: VASANTHA/061216; Library Ref: RESISTOR; Footprint Ref: RES0402_0-5; Library Path: Y:\MIS_DATABASE\Library\ALTIUM_TOOL\SCHEMATICS_PARTS\MS_DISCRETE_Library.schlib; Footprint Path: Y:\MIS_DATABASE\Library\ALTIUM_TOOL\PCB_FOOTPRINTS\Altium_Footprint_Lib.PcbLib
R449 = RESISTOR_Dup2: RES 100K 1/10W 5% 0402; Part Reference: R449; Part_type: RESISTORS\FIXED; Mfr_part_number: ERJ-2GEJ104X; Mfr_name: PANASONIC-ECG; Mistral Part No: 110009030177-R; Custom_Duty: 15%; Customs_HS_Code: 85332119; Voltage: NA; Project: RED EYE; Value: 100K; PCB Footprint: RES0402_0-5; Footprint Path: Y:\MIS_DATABASE\Library\ALTIUM_TOOL\PCB_FOOTPRINTS\Altium_Footprint_Lib.PcbLib; Library Path: Y:\MIS_DATABASE\Library\ALTIUM_TOOL\SCHEMATICS_PARTS\MS_DISCRETE_Library.schlib; MECHANICAL 3D STEP FILE: RES0402_0-5; Footprint Ref: RES0402_0-5; Library Ref: RESISTOR; Chkd/date: VASANTHA/291216; Crtd /date: GEETHA/190406; Datasheet: Y:\MIS_DATABASE\DATASHEETS\RESISTORS\PAN-ERJSER_NOV17.PDF; Temperature: -55°C+155°C; Weight: 0.8mg; Height: 0.40MM; Distributor_part_number: P100KJCT-ND; Distributor_name: DIGIKEY; Package: 0402; Wattage: 1/10W; Tolerance: 5%
R463 = RESISTOR_Dup2: RES 52.3K 1/20W 1% 0201; Part Reference: R463; Mistral Part No: 110009030972-R; Mfr_name: PANASONIC-ECG; Mfr_part_number: ERJ-1GNF5232C; Part_type: RESISTORS\FIXED; Project: GOLDEN-I LITE; Voltage: NA; Customs_HS_Code: 85332119; Custom_Duty: 15%; Value: 52.3K_1%; PCB Footprint: RES0201_0-5; Footprint Ref: RES0201_0-5; Tolerance: 1%; Wattage: 1/20W; Package: 0201; Distributor_name: DIGIKEY; Distributor_part_number: ERJ-1GNF5232C-ND; Library Ref: RESISTOR; Height: 0.26MM; Weight: 0.15mg; Temperature: -55°C+125°C; Datasheet: Y:\MIS_DATABASE\DATASHEETS\RESISTORS\PAN-ERJSER_NOV17.PDF; Crtd /date: MANIRAJA/270117; Chkd/date: VASANTHA/270117; MECHANICAL 3D STEP FILE: RES0201_0-5; Library Path: Y:\MIS_DATABASE\Library\ALTIUM_TOOL\SCHEMATICS_PARTS\MS_DISCRETE_Library.schlib; Footprint Path: Y:\MIS_DATABASE\Library\ALTIUM_TOOL\PCB_FOOTPRINTS\Altium_Footprint_Lib.PcbLib
R464 = RESISTOR_Dup2: RES 10K 1/20W 5% 0201; Part Reference: R464; Part_type: RESISTORS\FIXED; Mfr_part_number: RC0201JR-0710KL; Mfr_name: YAGEO AMERICA; Mistral Part No: 110010070051-R; Custom_Duty: 15%; Customs_HS_Code: 85332119; Voltage: NA; Project: GOLDEN-I LITE; Value: 10K; PCB Footprint: RES0201_0-5; MECHANICAL 3D STEP FILE: RES0201_0-5; Chkd/date: MANIRAJA/050517; Crtd /date: MANIRAJA/050517; Datasheet: Y:\MIS_DATABASE\DATASHEETS\RESISTORS\RCXXXXL-SER_MAR18.PDF; Temperature: -55°C+125°C; Weight: 0.17mg; Height: 0.26MM; Distributor_part_number: 311-10KNCT-ND; Distributor_name: DIGIKEY; Package: 0201; Wattage: 1/20W; Tolerance: 5%; Library Ref: RESISTOR; Footprint Ref: RES0201_0-5; Library Path: Y:\MIS_DATABASE\Library\ALTIUM_TOOL\SCHEMATICS_PARTS\MS_DISCRETE_Library.schlib; Footprint Path: Y:\MIS_DATABASE\Library\ALTIUM_TOOL\PCB_FOOTPRINTS\Altium_Footprint_Lib.PcbLib
R496 = RESISTOR_Dup2: RES 10K 1/20W 5% 0201; Part Reference: R496; Mistral Part No: 110010070051-R; Mfr_name: YAGEO AMERICA; Mfr_part_number: RC0201JR-0710KL; Part_type: RESISTORS\FIXED; Project: GOLDEN-I LITE; Voltage: NA; Customs_HS_Code: 85332119; Custom_Duty: 15%; Value: 10K; PCB Footprint: RES0201_0-5; Footprint Ref: RES0201_0-5; Tolerance: 5%; Wattage: 1/20W; Package: 0201; Distributor_name: DIGIKEY; Distributor_part_number: 311-10KNCT-ND; Library Ref: RESISTOR; Height: 0.26MM; Weight: 0.17mg; Temperature: -55°C+125°C; Datasheet: Y:\MIS_DATABASE\DATASHEETS\RESISTORS\RCXXXXL-SER_MAR18.PDF; Crtd /date: MANIRAJA/050517; Chkd/date: MANIRAJA/050517; MECHANICAL 3D STEP FILE: RES0201_0-5; Library Path: Y:\MIS_DATABASE\Library\ALTIUM_TOOL\SCHEMATICS_PARTS\MS_DISCRETE_Library.schlib; Footprint Path: Y:\MIS_DATABASE\Library\ALTIUM_TOOL\PCB_FOOTPRINTS\Altium_Footprint_Lib.PcbLib
U95 = TPS2553DBVR_SOT23-6: IC ADJ CURRENT-LIMITED POWER DISTRIBUTION SWITCHES SOT23-6; Part Reference: U95; Mistral Part No: 142018020023-R; Mfr_name: TEXAS INSTRUMENTS; Part_type: ICS\POWER; Project: GRACO SMART MODULE; Tolerance: NA; Customs_HS_Code: 85423100; Custom_Duty: 15%; Value: TPS2553DBVR; PCB Footprint: SOT23-6_1-5; Footprint Ref: SOT23-6_1-5; Mfr_part_number: TPS2553DBVR; Voltage: NA; Wattage: NA; Package: SOT23-6; Distributor_name: DIGIKEY; Distributor_part_number: 296-32464-1-ND; Library Ref: TPS2553DBVR_SOT23-6; Height: 1.45MM; Weight: 36mg; Temperature: -40°C+85°C; Datasheet: Y:\MIS_DATABASE\DATASHEETS\ICS\POWER\TPS2553XX.PDF; Crtd /date: ALVY/190218; Chkd/date: MANIRAJA/190218; MECHANICAL 3D STEP FILE: SOT23-6_1-5; Library Path: Y:\MIS_DATABASE\Library\ALTIUM_TOOL\SCHEMATICS_PARTS\MS_MISCPOWER_Library.schlib; Footprint Path: Y:\MIS_DATABASE\Library\ALTIUM_TOOL\PCB_FOOTPRINTS\Altium_Footprint_Lib.PcbLib